# Altium project Linear_Power_Supply.PrjPcb
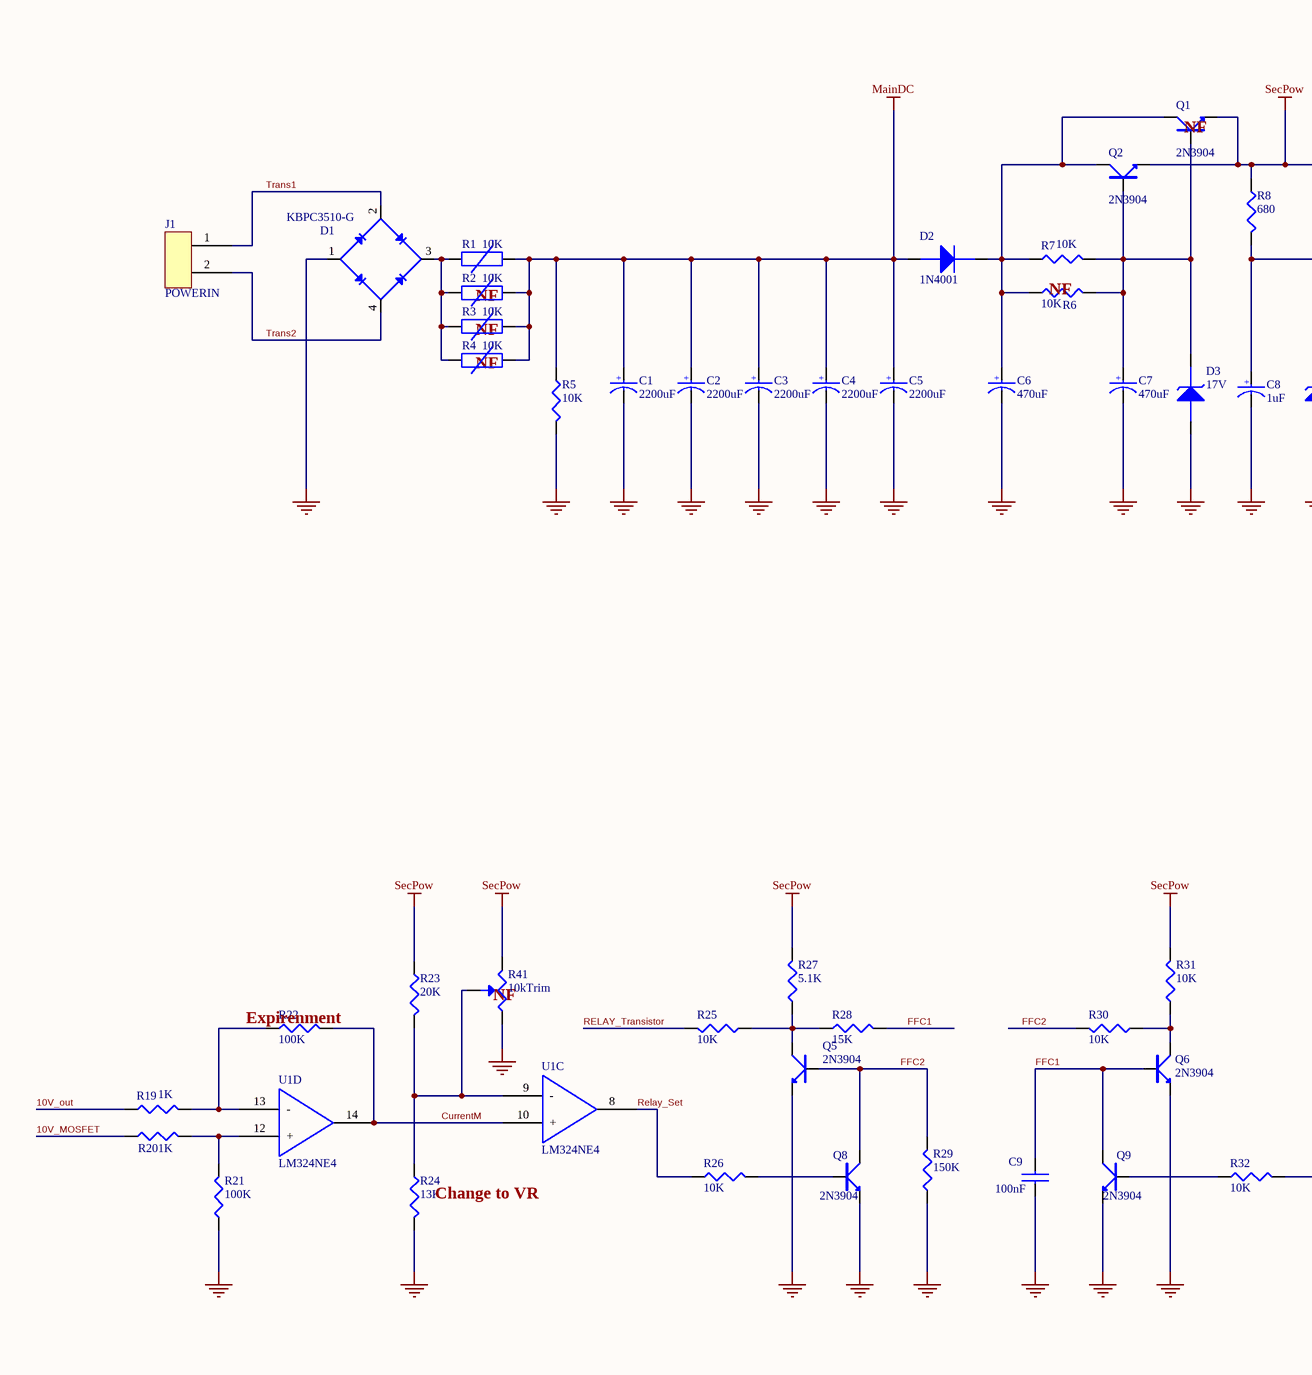
[diagram p0: schematic.SchDoc, left]
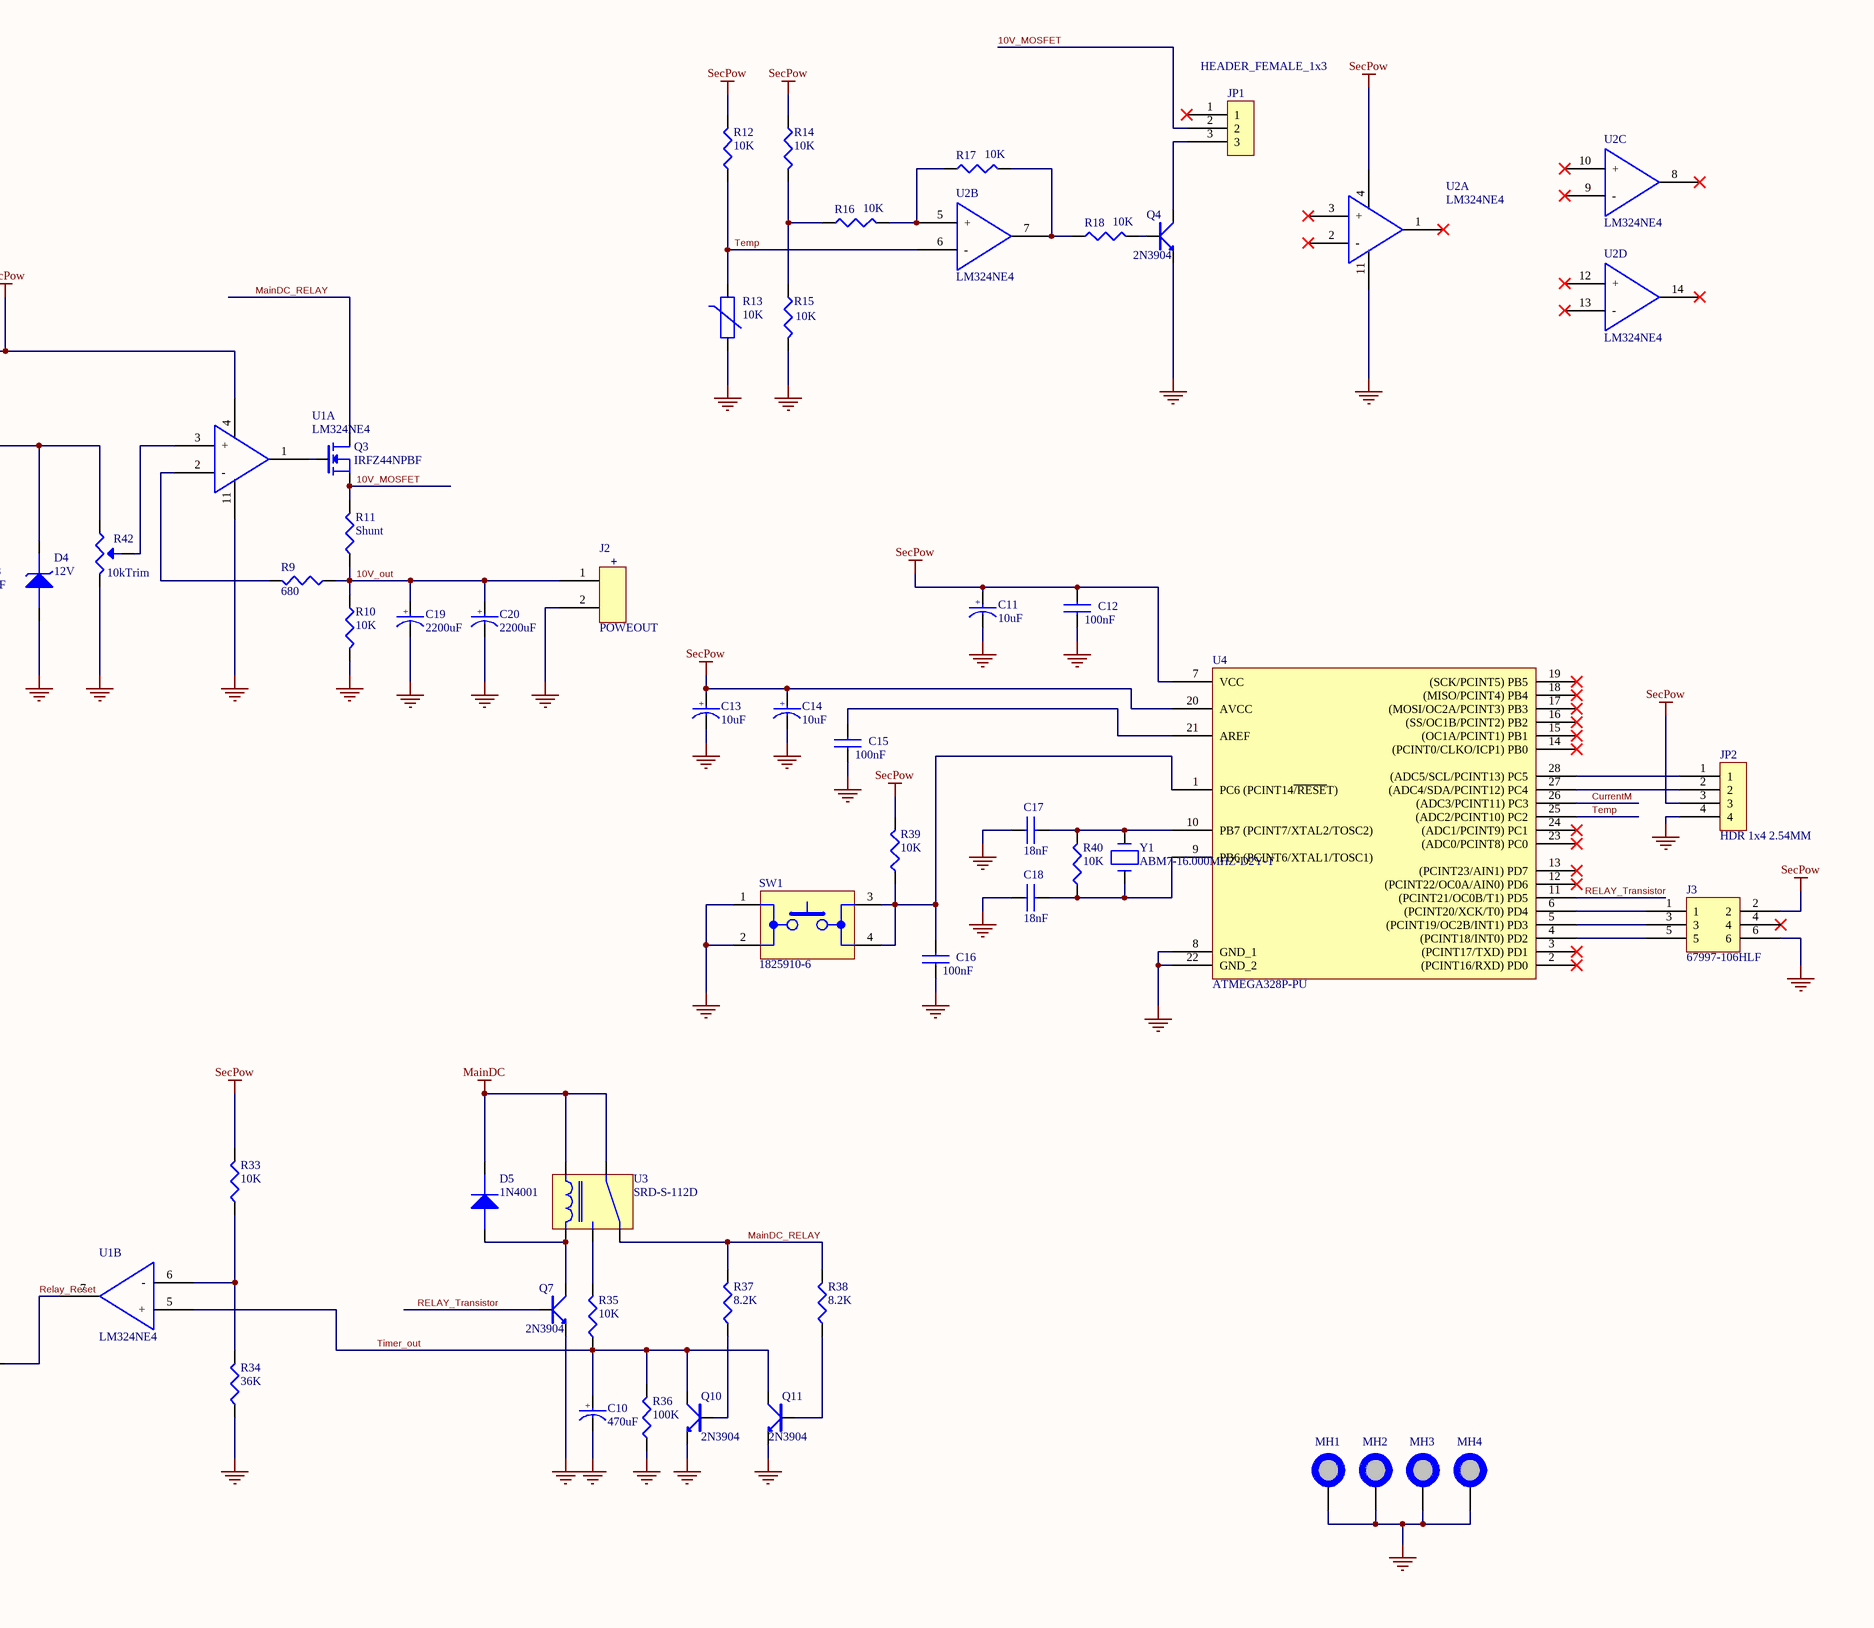
[diagram p1: schematic.SchDoc, right]
1 sheet, 93 parts. Net scope: global (net labels, ports and power ports of the same name join across sheets).
Board file: PCB.PcbDoc

## Sheet schematic.SchDoc
size 635 x 355 mm; SheetNumber: 1; SheetTotal: 1

### Parts
C1  2200uF  [CAP_3.5MM]
C2  2200uF  [CAP_3.5MM]
C3  2200uF  [CAP_3.5MM]
C4  2200uF  [CAP_3.5MM]
C5  2200uF  [CAP_3.5MM]
C6  470uF  [47uf3.5MM]
C7  470uF  [47uf3.5MM]
C8  1uF  [1uF2MM]
C9  100nF  [100nF3MM]
C10  470uF  [47uf3.5MM]
C11  10uF  [1uF2MM]
C12  100nF  [100nF3MM]
C13  10uF  [1uF2MM]
C14  10uF  [1uF2MM]
C15  100nF  [100nF3MM]
C16  100nF  [100nF3MM]
C17  18nF  [100nF3MM]
C18  18nF  [100nF3MM]
C19  2200uF  [CAP_3.5MM]
C20  2200uF  [CAP_3.5MM]
D1  KBPC3510-G  [RECTIFIER]
D2  1N4001  [1N4001]
D3  17V  [1N4001]
D4  12V  [1N4001]
D5  1N4001  [1N4001]
J1  POWERIN  [TR_CONN]
J2  POWEOUT  [Output]
J3  67997-106HLF  [HDR_2x3_2.54MM]
JP1  HEADER_FEMALE_1x3  [HDR_1x3_2.54MM]
JP2  HDR 1x4 2.54MM  [MALEHEADER_1x4_2.54MM]
MH1  Mounting_hole_17.4_3.2  [MH_17.4_3.2]  (value not drawn)  (no BOM)
MH2  Mounting_hole_17.4_3.2  [MH_17.4_3.2]  (value not drawn)  (no BOM)
MH3  Mounting_hole_17.4_3.2  [MH_17.4_3.2]  (value not drawn)  (no BOM)
MH4  Mounting_hole_17.4_3.2  [MH_17.4_3.2]  (value not drawn)  (no BOM)
Q1  2N3904  [2N3904]
Q2  2N3904  [2N3904]
Q3  IRFZ44NPBF  [IRFZ44N]
Q4  2N3904  [2N3904]
Q5  2N3904  [2N3904]
Q6  2N3904  [2N3904]
Q7  2N3904  [2N3904]
Q8  2N3904  [2N3904]
Q9  2N3904  [2N3904]
Q10  2N3904  [2N3904]
Q11  2N3904  [2N3904]
R1  10K  [Thermistor]
R2  10K  [Thermistor]
R3  10K  [Thermistor]
R4  10K  [Thermistor]
R5  10K  [RES_0.25W]
R6  10K  [RES_0.25W]
R7  10K  [RES_0.25W]
R8  680  [RES_0.25W]
R9  680  [RES_0.25W]
R10  10K  [RES_0.25W]
R11  Shunt  [shunt]
R12  10K  [RES_0.25W]
R13  10K  [Thermistor]
R14  10K  [RES_0.25W]
R15  10K  [RES_0.25W]
R16  10K  [RES_0.25W]
R17  10K  [RES_0.25W]
R18  10K  [RES_0.25W]
R19  1K  [RES_0.25W]
R20  1K  [RES_0.25W]
R21  100K  [RES_0.25W]
R22  100K  [RES_0.25W]
R23  20K  [RES_0.25W]
R24  13K  [RES_0.25W]
R25  10K  [RES_0.25W]
R26  10K  [RES_0.25W]
R27  5.1K  [RES_0.25W]
R28  15K  [RES_0.25W]
R29  150K  [RES_0.25W]
R30  10K  [RES_0.25W]
R31  10K  [RES_0.25W]
R32  10K  [RES_0.25W]
R33  10K  [RES_0.25W]
R34  36K  [RES_0.25W]
R35  10K  [RES_0.25W]
R36  100K  [RES_0.25W]
R37  8.2K  [RES_0.25W]
R38  8.2K  [RES_0.25W]
R39  10K  [RES_0.25W]
R40  10K  [RES_0.25W]
R41  10kTrim  [TRIMPOT]
R42  10kTrim  [TRIMPOT]
SW1  1825910-6  [DIP41825910-6]
U1  LM324NE4  [DIP14]  (parts A,B,C,D of 4)
U2  LM324NE4  [DIP14]  (parts A,B,C,D of 4)
U3  SRD-S-112D  [RELAY_5PIN]
U4  ATMEGA328P-PU  [DIP28_7.62mm]
Y1  ABM7-16.000MHZ-D2Y-T  [Oscilator]

### Nets
GND: C1.2 C2.2 C3.2 C4.2 C5.2 C6.2 C7.2 C8.2 C9.1 C10.2 C11.2 C12.1 C13.2 C14.2 C15.1 C16.1 C17.2 C18.2 C19.2 C20.2 D1.1 D3.2(An) D4.2(An) J2.2 J3.6 JP2.4 MH1.1 MH2.1 MH3.1 MH4.1 Q4.1 Q5.1 Q6.1 Q7.1 Q8.1 Q9.1 Q10.1 Q11.1 R5.2 R10.2 R13.1 R15.2 R21.2 R24.1 R29.1 R34.1 R36.1 R41.2 R42.2 SW1.1 SW1.2 U1.11(GND) U2.11(GND) U4.8(GND_1) U4.22(GND_2)
MainDC: C1.1 C2.1 C3.1 C4.1 C5.1 D2.2(An) D5.1(Ca) R1.2 R2.2 R3.2 R4.2 R5.1 U3.1 U3.5
SecPow: C11.1 C12.2 C13.1 C14.1 J3.2 JP2.3 Q1.1 Q2.1 R8.1 R12.2 R14.1 R23.2 R27.2 R31.2 R33.2 R39.2 R41.3 U1.4(VCC) U2.4(VCC) U4.7(VCC) U4.20(AVCC)
10V_MOSFET: JP1.2 Q3.3 R11.2 R20.1
10V_out: C19.1 C20.1 J2.1 R9.1 R10.1 R11.1 R19.1
CurrentM: R22.1 U1.10(+) U1.14(1OUT) U4.26((ADC3/PCINT11)_PC3)
FFC1: C9.2 Q6.2 Q9.3 R28.2
FFC2: Q5.2 Q8.3 R29.2 R30.2
MainDC_RELAY: Q3.2 R37.2 R38.2 U3.4
Relay_Reset: R32.2 U1.7(OUT)
Relay_Set: R26.2 U1.8(OUT)
RELAY_Transistor: Q7.2 R25.2 U4.11((PCINT21/OC0B/T1)_PD5)
Temp: R12.1 R13.2 U2.6(-) U4.25((ADC2/PCINT10)_PC2)
Timer_out: C10.1 Q10.3 Q11.3 R35.1 R36.2 U1.5(+)
Trans1: D1.2 J1.1
Trans2: D1.4 J1.2
NetC6_1: C6.1 D2.1(Ca) Q1.3 Q2.3 R6.1 R7.1
NetC7_1: C7.1 D3.1(Ca) Q1.2 Q2.2 R6.2 R7.2
NetC8_1: C8.1 D4.1(Ca) R8.2 R42.3
NetC15_2: C15.2 U4.21(AREF)
NetC16_2: C16.2 R39.1 SW1.3 SW1.4 U4.1(PC6_(PCINT14~{/RESE}T))
NetC17_1: C17.1 R40.2 U4.10(PB7_(PCINT7/XTAL2/TOSC2)) Y1.2
NetC18_1: C18.1 R40.1 U4.9(PB6_(PCINT6/XTAL1/TOSC1)) Y1.1
NetD1_3: D1.3 R1.1 R2.1 R3.1 R4.1
NetD5_2: D5.2(An) Q7.3 U3.2
NetJ3_1: J3.1 U4.6((PCINT20/XCK/T0)_PD4)
NetJ3_3: J3.3 U4.5((PCINT19/OC2B/INT1)_PD3)
NetJ3_5: J3.5 U4.4((PCINT18/INT0)_PD2)
NetJP1_3: JP1.3 Q4.3
NetJP2_1: JP2.1 U4.28((ADC5/SCL/PCINT13)_PC5)
NetJP2_2: JP2.2 U4.27((ADC4/SDA/PCINT12)_PC4)
NetQ3_1: Q3.1 U1.1(1OUT)
NetQ4_2: Q4.2 R18.2
NetQ5_3: Q5.3 R25.1 R27.1 R28.1
NetQ6_3: Q6.3 R30.1 R31.1
NetQ8_2: Q8.2 R26.1
NetQ9_2: Q9.2 R32.1
NetQ10_2: Q10.2 R37.1
NetQ11_2: Q11.2 R38.1
NetR9_2: R9.2 U1.2(-)
NetR14_2: R14.2 R15.1 R16.1
NetR16_2: R16.2 R17.1 U2.5(+)
NetR17_2: R17.2 R18.1 U2.7(OUT)
NetR19_2: R19.2 R22.2 U1.13(-)
NetR20_2: R20.2 R21.1 U1.12(+)
NetR23_1: R23.1 R24.2 R41.1 U1.9(-)
NetR33_1: R33.1 R34.2 U1.6(-)
NetR35_2: R35.2 U3.3
NetR42_1: R42.1 U1.3(+)

Not connected (* = marked no-connect by the designer): J3 4*; JP1 1*; U2 1(1OUT)* 2(-)* 3(+)* 8(OUT)* 9(-)* 10(+)* 12(+)* 13(-)* 14(1OUT)*; U4 2((PCINT16/RXD)_PD0)* 3((PCINT17/TXD)_PD1)* 12((PCINT22/OC0A/AIN0)_PD6)* 13((PCINT23/AIN1)_PD7)* 14((PCINT0/CLKO/ICP1)_PB0)* 15((OC1A/PCINT1)_PB1)* 16((SS/OC1B/PCINT2)_PB2)* 17((MOSI/OC2A/PCINT3)_PB3)* 18((MISO/PCINT4)_PB4)* 19((SCK/PCINT5)_PB5)* 23((ADC0/PCINT8)_PC0)* 24((ADC1/PCINT9)_PC1)*

### Notes on the sheet
- (near Q1) NF
- (near R6) NF
- (near R2) NF
- (near R3) NF
- (near R4) NF
- (near R22) Expirenment
- (near R41) NF
- (near R24) Change to VR
- (in symbol 1uF) +
- (in symbol 47uF) +
- (in symbol OUTPUT) +
- (in symbol UHE1V471MHD6) +

### Library data of the parts
C1-C5 C19 C20 = UHE1V471MHD6: Cap Aluminum Lytic 470uF 35V 20% (12.5 X 15mm) Radial 5mm 1450mA 10000h 105 Bulk; Manufacturer: Nichicon; Dielectric Material: Aluminium; Ripple Current: 1.45A; Impedance: 49mR; Life (Hours): 10000Hour; ESR (Equivalent Series Resistance): 160mR; Leakage Current: 164.5uA; Dissipation Factor: 0.12%; Lead Diameter: 0.8mm; Supplier 1: Digi-Key; Manufacturer Part Number: UHE1V471MHD6; RoHS: Yes; Category: Aluminum Electrolytic Capacitors; Stock 1: 6165; Pricing 1: 1=0.93000, 10=0.68400, 50=0.54700, 100=0.46890, 500=0.37124, 1000=0.31262, 2500=0.29308, 5000=0.27354 (USD); Mount: Through Hole; Case/Package: Radial; Min Operating Temperature: -40°C; Max Operating Temperature: 105°C; Capacitance: 470uF; Tolerance: 20%; Voltage Rating: 35V; Packaging: Bulk; Termination: Radial; Package Quantity: 100; Voltage Rating (DC): 35V; Series: HE; Diameter: 12.5mm; Length: 15mm; Height: 15mm; Lead Pitch: 5mm; Height - Seated (Max): 0.591inch; Radiation Hardening: No; RoHS Compliant: Yes; Lead Free: Lead Free; ComponentLink1URL: https://datasheet.ciiva.com/98/e-he-98887.pdf?src-supplier=Digi-Key; ComponentLink1Description: https://datasheet.ciiva.com/98/e-he-98887.pdf?src-supplier=Digi-Key; ComponentLink2URL: https://datasheet.ciiva.com/11683/e-he-11683294.pdf?src-supplier=Avnet; ComponentLink2Description: https://datasheet.ciiva.com/11683/e-he-11683294.pdf?src-supplier=Avnet; Supplier Part Number 1: 493-1583-ND
C6 C7 C10 = 47uF: Cap Aluminum Lytic 470uF 25V 20% (12.5 X 15mm) Radial 5mm 1450mA 10000h 105 Bulk; Manufacturer: Nichicon; Manufacturer Part Number: UHE1V471MHD6; Dielectric Material: Aluminium; Voltage Rating: 35V; Ripple Current: 1.45A; Impedance: 49mR; Life (Hours): 10000Hour; ESR (Equivalent Series Resistance): 160mR; Leakage Current: 164.5uA; Dissipation Factor: 0.12%; Lead Diameter: 0.8mm; Supplier 1: Digi-Key; RoHS: Yes; Category: Aluminum Electrolytic Capacitors; Stock 1: 6165; Pricing 1: 1=0.93000, 10=0.68400, 50=0.54700, 100=0.46890, 500=0.37124, 1000=0.31262, 2500=0.29308, 5000=0.27354 (USD); Mount: Through Hole; Case/Package: Radial; Min Operating Temperature: -40°C; Max Operating Temperature: 105°C; Capacitance: 470uF; Tolerance: 20%; Packaging: Bulk; Termination: Radial; Package Quantity: 100; Voltage Rating (DC): 35V; Series: HE; Diameter: 12.5mm; Length: 15mm; Height: 15mm; Lead Pitch: 5mm; Height - Seated (Max): 0.591inch; Radiation Hardening: No; RoHS Compliant: Yes; Lead Free: Lead Free; ComponentLink1URL: https://datasheet.ciiva.com/98/e-he-98887.pdf?src-supplier=Digi-Key; ComponentLink1Description: https://datasheet.ciiva.com/98/e-he-98887.pdf?src-supplier=Digi-Key; ComponentLink2URL: https://datasheet.ciiva.com/11683/e-he-11683294.pdf?src-supplier=Avnet; ComponentLink2Description: https://datasheet.ciiva.com/11683/e-he-11683294.pdf?src-supplier=Avnet; Supplier Part Number 1: 493-1583-ND
C8 C11 C13 C14 = 1uF: Cap Aluminum Lytic 1uF 100V 20% (12.5 X 15mm) Radial 5mm 1450mA 10000h 105 Bulk; Manufacturer: Nichicon; Manufacturer Part Number: UHE1V471MHD6; Dielectric Material: Aluminium; Capacitance: 470uF; Voltage Rating: 35V; Ripple Current: 1.45A; Impedance: 49mR; Life (Hours): 10000Hour; ESR (Equivalent Series Resistance): 160mR; Leakage Current: 164.5uA; Dissipation Factor: 0.12%; Lead Diameter: 0.8mm; Supplier 1: Digi-Key; RoHS: Yes; Category: Aluminum Electrolytic Capacitors; Stock 1: 6165; Pricing 1: 1=0.93000, 10=0.68400, 50=0.54700, 100=0.46890, 500=0.37124, 1000=0.31262, 2500=0.29308, 5000=0.27354 (USD); Mount: Through Hole; Case/Package: Radial; Min Operating Temperature: -40°C; Max Operating Temperature: 105°C; Tolerance: 20%; Packaging: Bulk; Termination: Radial; Package Quantity: 100; Voltage Rating (DC): 35V; Series: HE; Diameter: 12.5mm; Length: 15mm; Height: 15mm; Lead Pitch: 5mm; Height - Seated (Max): 0.591inch; Radiation Hardening: No; RoHS Compliant: Yes; Lead Free: Lead Free; ComponentLink1URL: https://datasheet.ciiva.com/98/e-he-98887.pdf?src-supplier=Digi-Key; ComponentLink1Description: https://datasheet.ciiva.com/98/e-he-98887.pdf?src-supplier=Digi-Key; ComponentLink2URL: https://datasheet.ciiva.com/11683/e-he-11683294.pdf?src-supplier=Avnet; ComponentLink2Description: https://datasheet.ciiva.com/11683/e-he-11683294.pdf?src-supplier=Avnet; Supplier Part Number 1: 493-1583-ND
C9 C12 C15-C18 = 100nF: Cap Aluminum Lytic 1uF 100V 20% (12.5 X 15mm) Radial 5mm 1450mA 10000h 105 Bulk; Manufacturer: Nichicon; Manufacturer Part Number: UHE1V471MHD6; Dielectric Material: Aluminium; Capacitance: 470uF; Voltage Rating: 35V; Ripple Current: 1.45A; Impedance: 49mR; Life (Hours): 10000Hour; ESR (Equivalent Series Resistance): 160mR; Leakage Current: 164.5uA; Dissipation Factor: 0.12%; Lead Diameter: 0.8mm; Supplier 1: Digi-Key; RoHS: Yes; Category: Aluminum Electrolytic Capacitors; Stock 1: 6165; Pricing 1: 1=0.93000, 10=0.68400, 50=0.54700, 100=0.46890, 500=0.37124, 1000=0.31262, 2500=0.29308, 5000=0.27354 (USD); Mount: Through Hole; Case/Package: Radial; Min Operating Temperature: -40°C; Max Operating Temperature: 105°C; Tolerance: 20%; Packaging: Bulk; Termination: Radial; Package Quantity: 100; Voltage Rating (DC): 35V; Series: HE; Diameter: 12.5mm; Length: 15mm; Height: 15mm; Lead Pitch: 5mm; Height - Seated (Max): 0.591inch; Radiation Hardening: No; RoHS Compliant: Yes; Lead Free: Lead Free; ComponentLink1URL: https://datasheet.ciiva.com/98/e-he-98887.pdf?src-supplier=Digi-Key; ComponentLink1Description: https://datasheet.ciiva.com/98/e-he-98887.pdf?src-supplier=Digi-Key; ComponentLink2URL: https://datasheet.ciiva.com/11683/e-he-11683294.pdf?src-supplier=Avnet; ComponentLink2Description: https://datasheet.ciiva.com/11683/e-he-11683294.pdf?src-supplier=Avnet; Supplier Part Number 1: 493-1583-ND
D1 = KBPC3510-G: Rectifier Bridge Diode Single 1KV 35A 4-Pin Case KBPC Box; Manufacturer: Comchip; Supplier 1: Digi-Key; Manufacturer Part Number: KBPC3510-G; RoHS: Yes; Category: Uncategorized; Stock 1: 792; Pricing 1: 1=10.58000, 10=9.55500, 50=9.11020, 100=7.91030, 250=7.55480, 450=6.88820, 950=5.99940 (USD); Mount: Surface Mount; Package Quantity: 50; Packaging: Bulk; Series: KBPC3510; RoHS Compliant: Yes; ComponentLink1URL: https://datasheet.ciiva.com/886/kbpc10005-gthru225890-kbpc5010-gseriesreva-886897.pdf?src-supplier=Digi-Key; ComponentLink1Description: https://datasheet.ciiva.com/886/kbpc10005-gthru225890-kbpc5010-gseriesreva-886897.pdf?src-supplier=Digi-Key; Supplier Part Number 1: 641-1858-ND
D2 D5 = 1N4001: Rectifier Diode, 1 Element, 1A, 50V V(RRM), Silicon, DO-41; Manufacturer: ON Semiconductor / Fairchild; Max Reverse Current: 5uA; Max Surge Current: 30A; Element Configuration: Single; Forward Voltage: 1.1V; Polarity: Standard; Capacitance: 15pF; Power Dissipation: 3W; Supplier 1: Avnet; Manufacturer Part Number: 1N4001; RoHS: Yes; Category: Rectifier Diodes; Stock 1: 326522; Pricing 1: 32052=0.01000 (USD); Mount: Through Hole; Number of Pins: 2; Contact Plating: Tin,Matte; Weight: 0.245g; Min Operating Temperature: -55°C; Max Operating Temperature: 175°C; Packaging: Tape and Reel; Max Repetitive Reverse Voltage (Vrrm): 50V; Max Forward Surge Current (Ifsm): 30A; Package Quantity: 1000; Average Rectified Current: 1A; Peak Non-Repetitive Surge Current: 30A; Max Reverse Voltage (DC): 50V; Reverse Voltage: 50V; Forward Current: 1A; Voltage Rating (DC): 50V; Current Rating: 1A; Output Current: 1A; Diameter: 2.72mm; Length: 5.2mm; Width: 0.25inch; Height: 5.2mm; Radiation Hardening: No; RoHS Compliant: Yes; REACH SVHC: No SVHC; Lead Free: Lead Free; ComponentLink1URL: https://datasheet.ciiva.com/910/1n4001-910352.pdf?src-supplier=Avnet; ComponentLink1Description: https://datasheet.ciiva.com/910/1n4001-910352.pdf?src-supplier=Avnet; ComponentLink2URL: https://datasheet.ciiva.com/910/1n4001-910352.pdf?src-supplier=Digi-Key; ComponentLink2Description: https://datasheet.ciiva.com/910/1n4001-910352.pdf?src-supplier=Digi-Key; ComponentLink3URL: https://datasheet.ciiva.com/4452/1n4004-81693-4452416.pdf?src-supplier=Mouser; ComponentLink3Description: https://datasheet.ciiva.com/4452/1n4004-81693-4452416.pdf?src-supplier=Mouser; ComponentLink4URL: https://datasheet.ciiva.com/30479/0900766b810c07cd-30479188.pdf?src-supplier=RSComponents; ComponentLink4Description: https://datasheet.ciiva.com/30479/0900766b810c07cd-30479188.pdf?src-supplier=RSComponents; ComponentLink5URL: https://datasheet.ciiva.com/15208/getdatasheetpartid-148723-15208346.pdf?src-supplier=Verical; ComponentLink5Description: https://datasheet.ciiva.com/15208/getdatasheetpartid-148723-15208346.pdf?src-supplier=Verical; ComponentLink6URL: https://datasheet.ciiva.com/8084/1n4007-8084076.pdf?src-supplier=Avnet; ComponentLink6Description: https://datasheet.ciiva.com/8084/1n4007-8084076.pdf?src-supplier=Avnet; ComponentLink7URL: https://datasheet.ciiva.com/910/1n4001-910353.pdf?src-supplier=Digi-Key; ComponentLink7Description: https://datasheet.ciiva.com/910/1n4001-910353.pdf?src-supplier=Digi-Key; ComponentLink8URL: https://datasheet.ciiva.com/927/1n4001-d-927540.pdf?src-supplier=Digi-Key; ComponentLink8Description: https://datasheet.ciiva.com/927/1n4001-d-927540.pdf?src-supplier=Digi-Key; ComponentLink9URL: https://datasheet.ciiva.com/22651/1923868-22651932.pdf?src-supplier=Element14; ComponentLink9Description: https://datasheet.ciiva.com/22651/1923868-22651932.pdf?src-supplier=Element14; ComponentLink10URL: https://datasheet.ciiva.com/22685/1504060-22685765.pdf?src-supplier=Element14; ComponentLink10Description: https://datasheet.ciiva.com/22685/1504060-22685765.pdf?src-supplier=Element14; Supplier Part Number 1: 1N4001
D3 D4 = 17v_zener: Zener Diode, 1 Element, 1A, 50V V(RRM), Silicon, DO-41; Manufacturer: ON Semiconductor / Fairchild; Max Reverse Current: 5uA; Max Surge Current: 30A; Element Configuration: Single; Forward Voltage: 1.1V; Polarity: Standard; Capacitance: 15pF; Power Dissipation: 3W; Supplier 1: Avnet; Manufacturer Part Number: 1N4001; RoHS: Yes; Category: Rectifier Diodes; Stock 1: 326522; Pricing 1: 32052=0.01000 (USD); Mount: Through Hole; Number of Pins: 2; Contact Plating: Tin,Matte; Weight: 0.245g; Min Operating Temperature: -55°C; Max Operating Temperature: 175°C; Packaging: Tape and Reel; Max Repetitive Reverse Voltage (Vrrm): 50V; Max Forward Surge Current (Ifsm): 30A; Package Quantity: 1000; Average Rectified Current: 1A; Peak Non-Repetitive Surge Current: 30A; Max Reverse Voltage (DC): 50V; Reverse Voltage: 50V; Forward Current: 1A; Voltage Rating (DC): 50V; Current Rating: 1A; Output Current: 1A; Diameter: 2.72mm; Length: 5.2mm; Width: 0.25inch; Height: 5.2mm; Radiation Hardening: No; RoHS Compliant: Yes; REACH SVHC: No SVHC; Lead Free: Lead Free; ComponentLink1URL: https://datasheet.ciiva.com/910/1n4001-910352.pdf?src-supplier=Avnet; ComponentLink1Description: https://datasheet.ciiva.com/910/1n4001-910352.pdf?src-supplier=Avnet; ComponentLink2URL: https://datasheet.ciiva.com/910/1n4001-910352.pdf?src-supplier=Digi-Key; ComponentLink2Description: https://datasheet.ciiva.com/910/1n4001-910352.pdf?src-supplier=Digi-Key; ComponentLink3URL: https://datasheet.ciiva.com/4452/1n4004-81693-4452416.pdf?src-supplier=Mouser; ComponentLink3Description: https://datasheet.ciiva.com/4452/1n4004-81693-4452416.pdf?src-supplier=Mouser; ComponentLink4URL: https://datasheet.ciiva.com/30479/0900766b810c07cd-30479188.pdf?src-supplier=RSComponents; ComponentLink4Description: https://datasheet.ciiva.com/30479/0900766b810c07cd-30479188.pdf?src-supplier=RSComponents; ComponentLink5URL: https://datasheet.ciiva.com/15208/getdatasheetpartid-148723-15208346.pdf?src-supplier=Verical; ComponentLink5Description: https://datasheet.ciiva.com/15208/getdatasheetpartid-148723-15208346.pdf?src-supplier=Verical; ComponentLink6URL: https://datasheet.ciiva.com/8084/1n4007-8084076.pdf?src-supplier=Avnet; ComponentLink6Description: https://datasheet.ciiva.com/8084/1n4007-8084076.pdf?src-supplier=Avnet; ComponentLink7URL: https://datasheet.ciiva.com/910/1n4001-910353.pdf?src-supplier=Digi-Key; ComponentLink7Description: https://datasheet.ciiva.com/910/1n4001-910353.pdf?src-supplier=Digi-Key; ComponentLink8URL: https://datasheet.ciiva.com/927/1n4001-d-927540.pdf?src-supplier=Digi-Key; ComponentLink8Description: https://datasheet.ciiva.com/927/1n4001-d-927540.pdf?src-supplier=Digi-Key; ComponentLink9URL: https://datasheet.ciiva.com/22651/1923868-22651932.pdf?src-supplier=Element14; ComponentLink9Description: https://datasheet.ciiva.com/22651/1923868-22651932.pdf?src-supplier=Element14; ComponentLink10URL: https://datasheet.ciiva.com/22685/1504060-22685765.pdf?src-supplier=Element14; ComponentLink10Description: https://datasheet.ciiva.com/22685/1504060-22685765.pdf?src-supplier=Element14; Supplier Part Number 1: 1N4001
J1 = TransformerConn: Connector for transformer; Manufacturer: Comchip; Manufacturer Part Number: KBPC3510-G; Supplier 1: Digi-Key; RoHS: Yes; Category: Uncategorized; Stock 1: 792; Pricing 1: 1=10.58000, 10=9.55500, 50=9.11020, 100=7.91030, 250=7.55480, 450=6.88820, 950=5.99940 (USD); Mount: Surface Mount; Package Quantity: 50; Packaging: Bulk; Series: KBPC3510; RoHS Compliant: Yes; ComponentLink1URL: https://datasheet.ciiva.com/886/kbpc10005-gthru225890-kbpc5010-gseriesreva-886897.pdf?src-supplier=Digi-Key; ComponentLink1Description: https://datasheet.ciiva.com/886/kbpc10005-gthru225890-kbpc5010-gseriesreva-886897.pdf?src-supplier=Digi-Key; Supplier Part Number 1: 641-1858-ND
J2 = OUTPUT: Connector for PowrOut; Manufacturer: Comchip; Manufacturer Part Number: KBPC3510-G; Supplier 1: Digi-Key; RoHS: Yes; Category: Uncategorized; Stock 1: 792; Pricing 1: 1=10.58000, 10=9.55500, 50=9.11020, 100=7.91030, 250=7.55480, 450=6.88820, 950=5.99940 (USD); Mount: Surface Mount; Package Quantity: 50; Packaging: Bulk; Series: KBPC3510; RoHS Compliant: Yes; ComponentLink1URL: https://datasheet.ciiva.com/886/kbpc10005-gthru225890-kbpc5010-gseriesreva-886897.pdf?src-supplier=Digi-Key; ComponentLink1Description: https://datasheet.ciiva.com/886/kbpc10005-gthru225890-kbpc5010-gseriesreva-886897.pdf?src-supplier=Digi-Key; Supplier Part Number 1: 641-1858-ND
J3 = 67997-106HLF: Conn Unshrouded Header HDR 6 POS 2.54mm Solder ST Top Entry Thru-Hole BergStik® Bulk; Manufacturer: ICC; Supplier 1: Newark; Manufacturer Part Number: 67997-106HLF; RoHS: No; Category: Headers and Wire Housings; Stock 1: 9; Pricing 1: 1=2.27000, 10=1.89000, 25=1.86000, 50=1.84000, 100=1.82000, 200=0.69900, 250=1.65000, 500=1.53000, 1000=1.33000, 2000=0.69900, 5000=0.69900 (USD); ComponentLink1URL: http://www.farnell.com/datasheets/1876884.pdf?src-supplier=Newark; ComponentLink1Description: http://www.farnell.com/datasheets/1876884.pdf?src-supplier=Newark; Supplier Part Number 1: 06M1758
JP1 = 68000-103HLF: Conn Unshrouded Header HDR 3 POS 2.54mm Solder ST Top Entry Thru-Hole BergStik® Automotive Bulk; Manufacturer: Amphenol ICC; Supplier 1: Allied Electronics; Manufacturer Part Number: 68000-103HLF; RoHS: Yes; Category: Headers and Wire Housings; RoHS Compliant: Yes; ComponentLink1URL: http://www.farnell.com/cad/1914865.pdf?src-supplier=Farnell; ComponentLink1Description: http://www.farnell.com/cad/1914865.pdf?src-supplier=Farnell; ComponentLink2URL: http://www.farnell.com/cad/1914865.pdf?src-supplier=Element14; ComponentLink2Description: http://www.farnell.com/cad/1914865.pdf?src-supplier=Element14; ComponentLink3URL: http://www.farnell.com/cad/1914865.pdf?src-supplier=Newark; ComponentLink3Description: http://www.farnell.com/cad/1914865.pdf?src-supplier=Newark; ComponentLink4URL: https://cdn.amphenol-icc.com/media/wysiwyg/files/drawing/68000.pdf?src-supplier=Digi-Key; ComponentLink4Description: https://cdn.amphenol-icc.com/media/wysiwyg/files/drawing/68000.pdf?src-supplier=Digi-Key; Supplier Part Number 1: 70236888
JP2 = 68001-204HLF: Conn Unshrouded Header HDR 4 POS 2.54mm Solder ST Thru-Hole Bag; Manufacturer: Amphenol ICC / FCI; Supplier 1: Allied Electronics; Manufacturer Part Number: 68001-204HLF; RoHS: No; Category: Headers and Wire Housings; Supplier Part Number 1: 70302499
MH1-MH4 = Mounting_hole_17.4_3.2: Mounting Hole plated
Q1 Q2 Q4-Q11 = 2N3904: Bipolar Transistor, TO-92, 40V, 200mA, NPN; Manufacturer: ON Semiconductor / Fairchild; Max Power Dissipation: 625mW; Element Configuration: Single; hFE Min: 100; Collector Base Voltage (VCBO): 60V; Emitter Base Voltage (VEBO): 6V; Collector Emitter Saturation Voltage: 300mV; Gain Bandwidth Product: 300MHz; Supplier 1: Bison Technologies; Manufacturer Part Number: 2N3904; RoHS: No; Category: BJTs; Stock 1: 1216; Case/Package: TO-92-3; Number of Pins: 3; Min Operating Temperature: -55°C; Max Operating Temperature: 150°C; Packaging: Bulk; Power Dissipation: 625mW; Polarity: NPN; Collector Emitter Voltage (VCEO): 40V; Collector Emitter Breakdown Voltage: 40V; Package Quantity: 5000; Max Collector Current: 200mA; Collector-emitter Voltage-Max: 40V; Series: 2N3904; REACH SVHC: No SVHC; RoHS Compliant: Yes; ComponentLink1URL: https://datasheet.ciiva.com/4725/2n3903-d-285841-4725808.pdf?src-supplier=Mouser; ComponentLink1Description: https://datasheet.ciiva.com/4725/2n3903-d-285841-4725808.pdf?src-supplier=Mouser; ComponentLink2URL: https://datasheet.ciiva.com/29323/163350-da-01-en-transistor-2n-3904-to92-fsc-29323035.pdf?src-supplier=Conrad; ComponentLink2Description: https://datasheet.ciiva.com/29323/163350-da-01-en-transistor-2n-3904-to92-fsc-29323035.pdf?src-supplier=Conrad; Supplier Part Number 1: 2N3904-296260-ON
Q3 = IRFZ44NPBF: MOSFET, Power; N-Ch; VDSS 55V; RDS(ON) 17.5 Milliohms; ID 49A; TO-220AB; PD 94W; -55deg; Manufacturer: International Rectifier; Rise Time: 60ns; Gate to Source Voltage (Vgs): 20V; Turn-Off Delay Time: 44ns; Turn-On Delay Time: 12ns; Fall Time: 45ns; Number of Elements: 1; Input Capacitance: 1.47nF; Rds On Max: 17.5mR; Nominal Vgs: 2.1V; Element Configuration: Single; Recovery Time: 95ns; Supplier 1: Newark; Manufacturer Part Number: IRFZ44NPBF; RoHS: Yes; Category: MOSFETs; Mount: Through Hole; Case/Package: TO-220AB; Number of Pins: 3; Min Operating Temperature: -55°C; Max Operating Temperature: 175°C; Continuous Drain Current (ID): 49A; Power Dissipation: 94W; Max Power Dissipation: 94W; Package Quantity: 50; Packaging: Rail/Tube; Drain to Source Voltage (Vdss): 55V; Drain to Source Breakdown Voltage: 55V; Drain to Source Resistance: 17.5mR; Voltage Rating (DC): 55V; Current Rating: 49A; On-State Resistance: 17.5MR; Dual Supply Voltage: 55V; Threshold Voltage: 2.1V; Termination: Through Hole; Length: 10.67mm; Width: 4.83mm; Height: 8.77mm; Lead Pitch: 2.54mm; Radiation Hardening: No; REACH SVHC: No SVHC; Lead Free: Lead Free; RoHS Compliant: Yes; ComponentLink1URL: https://datasheet.ciiva.com/939/irfz44npbf-939122.pdf?src-supplier=Digi-Key; ComponentLink1Description: https://datasheet.ciiva.com/939/irfz44npbf-939122.pdf?src-supplier=Digi-Key; ComponentLink2URL: https://datasheet.ciiva.com/29326/162747-da-01-en-irfz-44-n-29326623.pdf?src-supplier=Conrad; ComponentLink2Description: https://datasheet.ciiva.com/29326/162747-da-01-en-irfz-44-n-29326623.pdf?src-supplier=Conrad; ComponentLink3URL: https://datasheet.ciiva.com/26791/irfz44npbf-26791355.pdf?src-supplier=IIIC; ComponentLink3Description: https://datasheet.ciiva.com/26791/irfz44npbf-26791355.pdf?src-supplier=IIIC; ComponentLink4URL: https://datasheet.ciiva.com/8079/irfz44n-8079627.pdf?src-supplier=Element14; ComponentLink4Description: https://datasheet.ciiva.com/8079/irfz44n-8079627.pdf?src-supplier=Element14; ComponentLink5URL: https://datasheet.ciiva.com/7835/irfz44npbf-7835740.pdf?src-supplier=Element14; ComponentLink5Description: https://datasheet.ciiva.com/7835/irfz44npbf-7835740.pdf?src-supplier=Element14; ComponentLink6URL: https://datasheet.ciiva.com/16199/irfz44npbf-16199655.pdf?src-supplier=Future+Electronics; ComponentLink6Description: https://datasheet.ciiva.com/16199/irfz44npbf-16199655.pdf?src-supplier=Future+Electronics; Supplier Part Number 1: 38AH8483
R1-R4 R13 = Thermister_10K: Thermistor; Manufacturer: Yageo; Manufacturer Part Number: MFR-25FBF52-1K; Resistance: 1kR; Power Rating: 250mW; Tolerance: 1%; Voltage Rating: 250V; Temperature Coefficient: 100ppm/°C; Voltage Rating (DC): 200V; Lead Diameter: 0.6mm; Supplier 1: Digi-Key; RoHS: Yes; Category: Through-Hole Resistors; Stock 1: 63048; Pricing 1: 1=0.10000, 10=0.08000, 25=0.05560, 50=0.04320, 100=0.03080, 250=0.02404, 500=0.01910, 1000=0.01355, 5000=0.01047 (USD); Mount: Through Hole; Case/Package: Axial; Min Operating Temperature: -55°C; Max Operating Temperature: 155°C; Packaging: Bulk; Package Quantity: 200; Resistor Type: Metal Film; Termination: Axial; Number of Terminations: 2; Max Power Dissipation: 250mW; Series: MFR; Length: 0.248inch; Width: 6.3mm; Lead Free: Lead Free; RoHS Compliant: Yes; ComponentLink1URL: https://datasheet.ciiva.com/25646/yageolr-mfr-2013-25646206.pdf?src-supplier=Digi-Key; ComponentLink1Description: https://datasheet.ciiva.com/25646/yageolr-mfr-2013-25646206.pdf?src-supplier=Digi-Key; Supplier Part Number 1: 1.00KXBK-ND
R5-R7 R10 R12 R14-R18 R23 R25 R26 R28 R30-R33 R35 R39 R40 = MFR-25FRF52-10K: Res Metal Film 10K Ohm 1% 1/4W ±100ppm/°C Conformal Axial Thru-Hole T/R; Manufacturer: Yageo; Resistance: 10kR; Power Rating: 250mW; Voltage Rating: 250V; Voltage Rating (DC): 200V; Lead Diameter: 0.6mm; Supplier 1: Digi-Key; Manufacturer Part Number: MFR-25FRF52-10K; RoHS: Yes; Category: Through-Hole Resistors; Stock 1: 180000; Pricing 1: 5000=0.01047, 10000=0.00939, 25000=0.00862, 50000=0.00819 (USD); Case/Package: Axial; Min Operating Temperature: -55°C; Max Operating Temperature: 155°C; Packaging: Tape and Reel; Package Quantity: 5000; Tolerance: 1%; Resistor Type: Metal Film; Termination: Axial; Number of Terminations: 2; Temperature Coefficient: 100ppm/°C; Max Power Dissipation: 250mW; Series: MFR; Length: 0.248inch; Width: 6.3mm; Lead Free: Lead Free; RoHS Compliant: Yes; ComponentLink1URL: https://datasheet.ciiva.com/25645/yageolr-mfr-2013-25645549.pdf?src-supplier=Digi-Key; ComponentLink1Description: https://datasheet.ciiva.com/25645/yageolr-mfr-2013-25645549.pdf?src-supplier=Digi-Key; Supplier Part Number 1: 10.0KXTR-ND
R8 R9 = MFR-25FRF52-10K: Res Metal Film 680Ohm 1% 1/4W ±100ppm/°C Conformal Axial Thru-Hole T/R; Manufacturer: Yageo; Resistance: 10kR; Power Rating: 250mW; Voltage Rating: 250V; Voltage Rating (DC): 200V; Lead Diameter: 0.6mm; Supplier 1: Digi-Key; Manufacturer Part Number: MFR-25FRF52-10K; RoHS: Yes; Category: Through-Hole Resistors; Stock 1: 180000; Pricing 1: 5000=0.01047, 10000=0.00939, 25000=0.00862, 50000=0.00819 (USD); Case/Package: Axial; Min Operating Temperature: -55°C; Max Operating Temperature: 155°C; Packaging: Tape and Reel; Package Quantity: 5000; Tolerance: 1%; Resistor Type: Metal Film; Termination: Axial; Number of Terminations: 2; Temperature Coefficient: 100ppm/°C; Max Power Dissipation: 250mW; Series: MFR; Length: 0.248inch; Width: 6.3mm; Lead Free: Lead Free; RoHS Compliant: Yes; ComponentLink1URL: https://datasheet.ciiva.com/25645/yageolr-mfr-2013-25645549.pdf?src-supplier=Digi-Key; ComponentLink1Description: https://datasheet.ciiva.com/25645/yageolr-mfr-2013-25645549.pdf?src-supplier=Digi-Key; Supplier Part Number 1: 10.0KXTR-ND
R11 = Shunt: Manufacturer: Yageo; Manufacturer Part Number: MFR-25FTE52-36K; Resistance: 36kR; Power Rating: 250mW; Tolerance: 1%; Voltage Rating: 250V; Temperature Coefficient: 50ppm/°C; Voltage Rating (DC): 200V; Lead Diameter: 0.6mm; Supplier 1: Digi-Key; RoHS: Yes; Category: Through-Hole Resistors; Stock 1: 3420; Pricing 1: 1=0.10000, 10=0.08200, 25=0.05680, 50=0.04400, 100=0.03150, 250=0.02456, 500=0.01952, 1000=0.01386 (USD); Mount: Through Hole; Case/Package: Metal; Min Operating Temperature: -55°C; Max Operating Temperature: 155°C; Termination: Axial; Packaging: Ammo Pack; Resistor Type: Metal Film; Series: MFR; Length: 2.4mm; Width: 6.3mm; ComponentLink1URL: http://www.yageo.com/documents/recent/Leaded-R_MFR_2011.pdf?src-supplier=Mouser; ComponentLink1Description: http://www.yageo.com/documents/recent/Leaded-R_MFR_2011.pdf?src-supplier=Mouser; ComponentLink2URL: https://www.yageo.com/upload/media/product/products/datasheet/lr/Yageo_LR_MFR_1.pdf?src-supplier=Digi-Key; ComponentLink2Description: https://www.yageo.com/upload/media/product/products/datasheet/lr/Yageo_LR_MFR_1.pdf?src-supplier=Digi-Key; Supplier Part Number 1: 13-MFR-25FTE52-36KCT-ND
R19 R20 R37 R38 = MFR-25FBF52-1K: General Type Metal Film Resistor 1kOhm 1/4W 1% Axial Bulk; Manufacturer: Yageo; Resistance: 1kR; Power Rating: 250mW; Voltage Rating: 250V; Temperature Coefficient: 100ppm/°C; Voltage Rating (DC): 200V; Lead Diameter: 0.6mm; Supplier 1: Digi-Key; Manufacturer Part Number: MFR-25FBF52-1K; RoHS: Yes; Category: Through-Hole Resistors; Stock 1: 63048; Pricing 1: 1=0.10000, 10=0.08000, 25=0.05560, 50=0.04320, 100=0.03080, 250=0.02404, 500=0.01910, 1000=0.01355, 5000=0.01047 (USD); Mount: Through Hole; Case/Package: Axial; Min Operating Temperature: -55°C; Max Operating Temperature: 155°C; Tolerance: 1%; Packaging: Bulk; Package Quantity: 200; Resistor Type: Metal Film; Termination: Axial; Number of Terminations: 2; Max Power Dissipation: 250mW; Series: MFR; Length: 0.248inch; Width: 6.3mm; Lead Free: Lead Free; RoHS Compliant: Yes; ComponentLink1URL: https://datasheet.ciiva.com/25646/yageolr-mfr-2013-25646206.pdf?src-supplier=Digi-Key; ComponentLink1Description: https://datasheet.ciiva.com/25646/yageolr-mfr-2013-25646206.pdf?src-supplier=Digi-Key; Supplier Part Number 1: 1.00KXBK-ND
R21 R22 R24 R34 = MFR-25FRF52-10K: Res Metal Film 36K Ohm 1% 1/4W ±100ppm/°C Conformal Axial Thru-Hole T/R; Manufacturer: Yageo; Resistance: 10kR; Power Rating: 250mW; Voltage Rating: 250V; Voltage Rating (DC): 200V; Lead Diameter: 0.6mm; Supplier 1: Digi-Key; Manufacturer Part Number: MFR-25FRF52-10K; RoHS: Yes; Category: Through-Hole Resistors; Stock 1: 180000; Pricing 1: 5000=0.01047, 10000=0.00939, 25000=0.00862, 50000=0.00819 (USD); Case/Package: Axial; Min Operating Temperature: -55°C; Max Operating Temperature: 155°C; Packaging: Tape and Reel; Package Quantity: 5000; Tolerance: 1%; Resistor Type: Metal Film; Termination: Axial; Number of Terminations: 2; Temperature Coefficient: 100ppm/°C; Max Power Dissipation: 250mW; Series: MFR; Length: 0.248inch; Width: 6.3mm; Lead Free: Lead Free; RoHS Compliant: Yes; ComponentLink1URL: https://datasheet.ciiva.com/25645/yageolr-mfr-2013-25645549.pdf?src-supplier=Digi-Key; ComponentLink1Description: https://datasheet.ciiva.com/25645/yageolr-mfr-2013-25645549.pdf?src-supplier=Digi-Key; Supplier Part Number 1: 10.0KXTR-ND
R27 = MFR-25FBF52-5K1: General Type Metal Film Resistor 5.1kOhm 1/4W 1% Axial Bulk; Manufacturer: Yageo; Resistance: 5.1kR; Power Rating: 250mW; Voltage Rating: 250V; Voltage Rating (DC): 200V; Supplier 1: Digi-Key; Manufacturer Part Number: MFR-25FBF52-5K1; RoHS: Yes; Category: Through-Hole Resistors; Stock 1: 4000; Pricing 1: 1=0.10000, 10=0.08000, 25=0.05560, 50=0.04320, 100=0.03080, 250=0.02404, 500=0.01910, 1000=0.01355, 5000=0.01047 (USD); Case/Package: Metal; Min Operating Temperature: -55°C; Max Operating Temperature: 155°C; Tolerance: 1%; Packaging: Bulk; Termination: Axial; ComponentLink1URL: http://www.mouser.com/ds/2/447/Yageo%20LR_MFR_2013-467719.pdf?src-supplier=Mouser; ComponentLink1Description: http://www.mouser.com/ds/2/447/Yageo%20LR_MFR_2013-467719.pdf?src-supplier=Mouser; ComponentLink2URL: https://www.yageo.com/upload/media/product/products/datasheet/lr/Yageo_LR_MFR_1.pdf?src-supplier=Digi-Key; ComponentLink2Description: https://www.yageo.com/upload/media/product/products/datasheet/lr/Yageo_LR_MFR_1.pdf?src-supplier=Digi-Key; Supplier Part Number 1: MFR-25FBF52-5K1-ND
R29 = MFR-25FBF52-150K: General Type Metal Film Resistor 150kOhm 1/4W 1% Axial Bulk; Manufacturer: Yageo; Resistance: 150kR; Power Rating: 250mW; Temperature Coefficient: 100ppm/°C; Voltage Rating (DC): 200V; Voltage Rating: 250V; Lead Diameter: 0.6mm; Supplier 1: Digi-Key; Manufacturer Part Number: MFR-25FBF52-150K; RoHS: Yes; Category: Through-Hole Resistors; Stock 1: 13526; Pricing 1: 1=0.10000, 10=0.08000, 25=0.05560, 50=0.04320, 100=0.03080, 250=0.02404, 500=0.01910, 1000=0.01355, 5000=0.01047 (USD); Mount: Through Hole; Case/Package: Axial; Min Operating Temperature: -55°C; Max Operating Temperature: 155°C; Tolerance: 1%; Package Quantity: 200; Packaging: Bulk; Number of Terminations: 2; Max Power Dissipation: 250mW; Resistor Type: Metal Film; Termination: Axial; Length: 0.248inch; Width: 6.3mm; ComponentLink1URL: https://datasheet.ciiva.com/5505/yageolr-mfr-2013-467719-5505320.pdf?src-supplier=Mouser; ComponentLink1Description: https://datasheet.ciiva.com/5505/yageolr-mfr-2013-467719-5505320.pdf?src-supplier=Mouser; Supplier Part Number 1: 150KXBK-ND
R36 = MFR-25FBF52-100K: Res General Purpose Metal Film 100k Ohm 1% 1/4W ±100ppm/°C Conformal Axial Bulk; Manufacturer: Yageo; Resistance: 100kR; Power Rating: 250mW; Voltage Rating (DC): 200V; Voltage Rating: 250V; Supplier 1: Digi-Key; Manufacturer Part Number: MFR-25FBF52-100K; RoHS: Yes; Category: Through-Hole Resistors; Stock 1: 14092; Pricing 1: 1=0.10000, 10=0.08000, 25=0.05560, 50=0.04320, 100=0.03080, 250=0.02404, 500=0.01910, 1000=0.01355, 5000=0.01047 (USD); Mount: Through Hole; Case/Package: Axial; Min Operating Temperature: -55°C; Max Operating Temperature: 155°C; Tolerance: 1%; Packaging: Bulk; Package Quantity: 200; Termination: Axial; Resistor Type: Metal Film; Number of Terminations: 2; Max Power Dissipation: 250mW; Temperature Coefficient: 100ppm/°C; Series: MFR; Construction: Cylindrical; Length: 0.248inch; RoHS Compliant: Yes; Military Standard: Not; ComponentLink1URL: https://datasheet.ciiva.com/25646/yageolr-mfr-2013-25646205.pdf?src-supplier=Digi-Key; ComponentLink1Description: https://datasheet.ciiva.com/25646/yageolr-mfr-2013-25646205.pdf?src-supplier=Digi-Key; Supplier Part Number 1: 100KXBK-ND
R41 R42 = trimpot: Res Metal Foil Trimmer 10K Ohm 5% 1/4W 21Turn Pin Thru-Hole Foam Pack/Box; Manufacturer: VPG Foil Resistors; Manufacturer Part Number: Y405310K0000J0L; Resistance: 10kR; Voltage Rating: 250V; Power Rating: 250mW; Number of Turns: 21; Temperature Coefficient: 10ppm/°C; Supplier 1: Digi-Key; RoHS: Yes; Category: Through-Hole Resistors; Stock 1: 485; Pricing 1: 1=68.06000, 10=61.58100, 25=51.85760, 50=48.61640, 100=46.99580 (USD); Mount: Through Hole,PCB; Case/Package: Metal; Weight: 0.01411oz; Min Operating Temperature: -55°C; Max Operating Temperature: 150°C; Tolerance: 5%; Packaging: Bulk; Package Quantity: 25; Resistor Type: Metal Foil; Termination: Pin; Taper: Linear; Max Power Dissipation: 250mW; Series: 1240; Technology: METAL FOIL; Resistance Tolerance: 5%; Length: 6.35mm; Width: 4.45mm; Height: 6.35mm; Depth: 4.45mm; Radiation Hardening: No; Military Standard: Not; REACH SVHC: Unknown; RoHS Compliant: Yes; ComponentLink1URL: https://datasheet.ciiva.com/25604/0900766b81142c85-25604224.pdf?src-supplier=RSComponents; ComponentLink1Description: https://datasheet.ciiva.com/25604/0900766b81142c85-25604224.pdf?src-supplier=RSComponents; ComponentLink2URL: https://datasheet.ciiva.com/2165/1240-2165920.pdf?src-supplier=Digi-Key; ComponentLink2Description: https://datasheet.ciiva.com/2165/1240-2165920.pdf?src-supplier=Digi-Key; ComponentLink3URL: https://datasheet.ciiva.com/8699/1240-8699514.pdf?src-supplier=Avnet; ComponentLink3Description: https://datasheet.ciiva.com/8699/1240-8699514.pdf?src-supplier=Avnet; ComponentLink4URL: https://datasheet.ciiva.com/17559/1240-17559583.pdf?src-supplier=Avnet+Europe; ComponentLink4Description: https://datasheet.ciiva.com/17559/1240-17559583.pdf?src-supplier=Avnet+Europe
SW1 = 1825910-6: Switch Tactile OFF (ON) SPST Round Button PC Pins 0.05A 24VDC 1.57N Thru-Hole Loose; Manufacturer: TE Connectivity Alcoswitch; Mechanical Life: 100000Cycles; Actuator Material: PBT; Actuator Color: Black; Max Current Rating: 50mA; Operating Force: 160gf; Illumination Type: Non-Illuminated,Illuminated; Switch Travel: 0.25mm; Switch Function: Off-Mom; Max Voltage Rating (DC): 24V; Contact Resistance: 100mR; Actuator Type: Standard; Actuator Length: 0.055inch; Supplier 1: Digi-Key; Manufacturer Part Number: 1825910-6; RoHS: Yes; Category: Pushbutton Switches; Stock 1: 147083; Pricing 1: 1=0.12000, 10=0.11300, 25=0.10720, 100=0.09750, 250=0.09164, 500=0.08382, 1000=0.07018, 2500=0.06823, 5000=0.06433 (USD); Mount: Through Hole; Contact Material: Copper Alloy; Contact Plating: Silver; Min Operating Temperature: -35°C; Max Operating Temperature: 85°C; Throw Configuration: SPST; Packaging: Loose Piece; Termination: PC Pins; Orientation: Straight; Contact Current Rating: 50mA; Type: Switch; Series: FSMJ; Package Quantity: 750; Electrical Life: 100000Cycles; Length: 5.99mm; RoHS Compliant: Yes; REACH SVHC: Unknown; ELV: Compliant; Lead Free: Lead Free; ComponentLink1URL: https://datasheet.ciiva.com/30199/1825910-6rqpn1825910-6-30199520.pdf?src-supplier=Onlinecomponents.com; ComponentLink1Description: https://datasheet.ciiva.com/30199/1825910-6rqpn1825910-6-30199520.pdf?src-supplier=Onlinecomponents.com; ComponentLink2URL: https://datasheet.ciiva.com/15184/getdatasheetpartid-395915-15184509.pdf?src-supplier=Verical; ComponentLink2Description: https://datasheet.ciiva.com/15184/getdatasheetpartid-395915-15184509.pdf?src-supplier=Verical; Supplier Part Number 1: 450-1650-ND
U1 U2 = LM324NE4: 4-Channel industry standard operational amplifier 14-PDIP 0 to 70; Manufacturer: Texas Instruments; Unity Gain Bandwidth Product: 1.2MHz; Slew Rate: 0.5V/µs; Common Mode Rejection Ratio: 65dB; Max Supply Voltage: 32V; Min Supply Voltage: 3V; Min Dual Supply Voltage: 1.5V; Max Dual Supply Voltage: 16V; Voltage Gain: 100dB; Number of Channels: 4; Output Current: 30mA; Nominal Supply Current: 3mA; Input Offset Voltage (Vos): 7mV; Input Bias Current: 250nA; Operating Supply Current: 1.4mA; Output Current per Channel: 60mA; Max Supply Current: 700uA; Amplifier Type: GENERAL PURPOSE; Supplier 1: Digi-Key; Manufacturer Part Number: LM324NE4; RoHS: Yes; Category: Amplifiers - Op Amps, Buffer, Instrumentation; Stock 1: 2879; Pricing 1: 1=0.70000, 10=0.61200, 25=0.57520, 100=0.46930, 250=0.43592, 500=0.37100, 1000=0.30625 (USD); Mount: Through Hole; Case/Package: PDIP; Number of Pins: 14; Min Operating Temperature: 0°C; Max Operating Temperature: 70°C; Packaging: Rail/Tube; Operating Supply Voltage: 16V; Dual Supply Voltage: 3V; Package Quantity: 25; Gain Bandwidth Product: 1.2MHz; Number of Circuits: 4; Number of Elements: 4; Bandwidth: 1.2MHz; Supply Current: 3mA; Technology: BIPOLAR; Series: -; Length: 19.3mm; Width: 6.35mm; Height: 4.57mm; Radiation Hardening: No; Lead Free: Lead Free; RoHS Compliant: Yes; ComponentLink1URL: https://datasheet.ciiva.com/19477/826671-19477011.pdf?src-supplier=Jameco; ComponentLink1Description: https://datasheet.ciiva.com/19477/826671-19477011.pdf?src-supplier=Jameco; ComponentLink2URL: https://datasheet.ciiva.com/18622/lm224-18622488.pdf?src-supplier=Digi-Key; ComponentLink2Description: https://datasheet.ciiva.com/18622/lm224-18622488.pdf?src-supplier=Digi-Key; ComponentLink3URL: https://datasheet.ciiva.com/2973/lm324ka-2973359.pdf?src-supplier=Avnet; ComponentLink3Description: https://datasheet.ciiva.com/2973/lm324ka-2973359.pdf?src-supplier=Avnet; Supplier Part Number 1: 296-36105-5-ND
U3 = SRD-S-112D: General Purpose Relay SPDT (1 Form C) 12VDC Coil Through Hole
U4 = ATMEGA328P-PU: ATMEGA328P-PU; 8 bit Microcontroller AVR 20MHz 1; 32kb Flash; 2kb RAM; I2C SPI 2; Manufacturer: Microchip / Atmel; Number of PWM Channels: 6; Number of Timers/Counters: 3; Min Supply Voltage: 1.8V; Max Supply Voltage: 5.5V; Interface: I2C,SPI,UART,USART,2-Wire; Number of I/Os: 23; Oscillator Type: Internal; Data Bus Width: 8b; Number of SPI Channels: 1; Watchdog Timer: Yes; Peripherals: Brown-out Detect/Reset,POR,PWM,WDT; Supplier 1: Allied Electronics; Manufacturer Part Number: ATMEGA328P-PU; RoHS: Yes; Category: Microcontrollers; Mount: Through Hole; Case/Package: PDIP; Number of Pins: 28; Contact Plating: Tin,Matte; Min Operating Temperature: -40°C; Max Operating Temperature: 85°C; Package Quantity: 14; Core Architecture: AVR; RAM Size: 2KB; Number of ADC Channels: 6; Packaging: Rail/Tube; Frequency: 20MHz; Number of Programmable I/O: 23; Max Frequency: 20MHz; Number of I2C Channels: 1; Memory Type: FLASH; Memory Size: 32KB; Series: AVR® ATmega; Length: 37.4mm; Width: 6.76mm; Height: 3.28mm; Radiation Hardening: No; REACH SVHC: No SVHC; Lead Free: Lead Free; RoHS Compliant: Yes; ComponentLink1URL: https://datasheet.ciiva.com/19457/2139111-19457070.pdf?src-supplier=Jameco; ComponentLink1Description: https://datasheet.ciiva.com/19457/2139111-19457070.pdf?src-supplier=Jameco; ComponentLink2URL: https://datasheet.ciiva.com/1157/1684409-1157696.pdf?src-supplier=Element14; ComponentLink2Description: https://datasheet.ciiva.com/1157/1684409-1157696.pdf?src-supplier=Element14; ComponentLink3URL: https://datasheet.ciiva.com/20168/73-4283-20168380.pdf?src-supplier=Rapid+Electronics; ComponentLink3Description: https://datasheet.ciiva.com/20168/73-4283-20168380.pdf?src-supplier=Rapid+Electronics; ComponentLink4URL: https://datasheet.ciiva.com/29119/155197-da-01-en-microcontr-atmega328p-pu-8bit-pdip-28-29119593.pdf?src-supplier=Conrad; ComponentLink4Description: https://datasheet.ciiva.com/29119/155197-da-01-en-microcontr-atmega328p-pu-8bit-pdip-28-29119593.pdf?src-supplier=Conrad; ComponentLink5URL: https://datasheet.ciiva.com/26818/atmega328p-pu-26818578.pdf?src-supplier=IIIC; ComponentLink5Description: https://datasheet.ciiva.com/26818/atmega328p-pu-26818578.pdf?src-supplier=IIIC; ComponentLink6URL: https://datasheet.ciiva.com/15213/getdatasheetpartid-318533-15213133.pdf?src-supplier=Verical; ComponentLink6Description: https://datasheet.ciiva.com/15213/getdatasheetpartid-318533-15213133.pdf?src-supplier=Verical; Supplier Part Number 1: 70332157
Y1 = ABM7-16.000MHZ-D2Y-T: Crystal 16MHz ±20ppm (Tol) ±30ppm (Stability) 18pF FUND 50Ohm 2-Pin Mini-CSMD T/R; Manufacturer: Abracon; ESR (Equivalent Series Resistance): 50R; Supplier 1: RSComponents; Manufacturer Part Number: ABM7-16.000MHZ-D2Y-T; RoHS: Yes; Category: Crystals; Stock 1: 710; Pricing 1: 1000=0.52200, 3000=0.50800 (USD); Mount: Surface Mount; Case/Package: CSMD; Number of Pins: 2; Min Operating Temperature: -40°C; Max Operating Temperature: 85°C; Frequency Tolerance: 20ppm; Load Capacitance: 18pF; Frequency: 16MHz; Package Quantity: 1000; Tolerance: 20ppm; Packaging: Tape and Reel; Frequency Stability: 30ppm; Termination: SMD/SMT; Resistor Type: Ceramic; Length: 6mm; Width: 3.3mm; Height: 0.055inch; Depth: 3.5mm; Radiation Hardening: No; REACH SVHC: Unknown; Lead Free: Lead Free; ComponentLink1URL: https://datasheet.ciiva.com/15116/getdatasheetpartid-721624-15116835.pdf?src-supplier=Verical; ComponentLink1Description: https://datasheet.ciiva.com/15116/getdatasheetpartid-721624-15116835.pdf?src-supplier=Verical; ComponentLink2URL: https://datasheet.ciiva.com/22658/947971-22658293.pdf?src-supplier=Element14; ComponentLink2Description: https://datasheet.ciiva.com/22658/947971-22658293.pdf?src-supplier=Element14; ComponentLink3URL: https://datasheet.ciiva.com/5788/abm7-5788054.pdf?src-supplier=Farnell; ComponentLink3Description: https://datasheet.ciiva.com/5788/abm7-5788054.pdf?src-supplier=Farnell; ComponentLink4URL: https://datasheet.ciiva.com/7998/947971-7998600.pdf?src-supplier=Element14; ComponentLink4Description: https://datasheet.ciiva.com/7998/947971-7998600.pdf?src-supplier=Element14; ComponentLink5URL: https://datasheet.ciiva.com/46385/947971-46385243.pdf?src-supplier=Element14; ComponentLink5Description: https://datasheet.ciiva.com/46385/947971-46385243.pdf?src-supplier=Element14; ComponentLink6URL: https://datasheet.ciiva.com/16383/abm7-16383174.pdf?src-supplier=Future+Electronics; ComponentLink6Description: https://datasheet.ciiva.com/16383/abm7-16383174.pdf?src-supplier=Future+Electronics; ComponentLink7URL: https://datasheet.ciiva.com/18649/abm7-18649865.pdf?src-supplier=Digi-Key; ComponentLink7Description: https://datasheet.ciiva.com/18649/abm7-18649865.pdf?src-supplier=Digi-Key; ComponentLink8URL: https://datasheet.ciiva.com/18649/abm7-18649866.pdf?src-supplier=Digi-Key; ComponentLink8Description: https://datasheet.ciiva.com/18649/abm7-18649866.pdf?src-supplier=Digi-Key; ComponentLink9URL: https://datasheet.ciiva.com/18649/abm7-18649867.pdf?src-supplier=Digi-Key; ComponentLink9Description: https://datasheet.ciiva.com/18649/abm7-18649867.pdf?src-supplier=Digi-Key; ComponentLink10URL: https://datasheet.ciiva.com/26941/getdatasheetpartid-719818-26941724.pdf?src-supplier=Verical; ComponentLink10Description: https://datasheet.ciiva.com/26941/getdatasheetpartid-719818-26941724.pdf?src-supplier=Verical; Supplier Part Number 1: 1710290